# Altium project LEDCube.PrjPCB
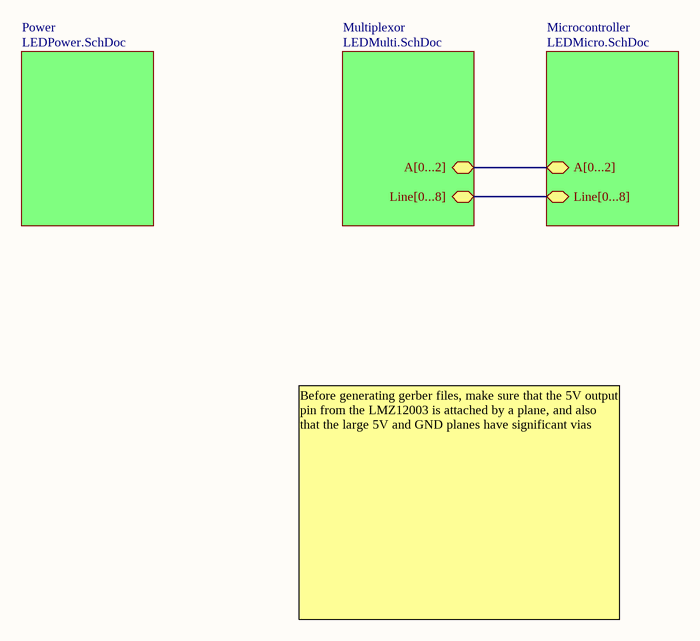
[diagram p0: Main.SchDoc]
4 sheets, 176 parts. Net scope: global (net labels, ports and power ports of the same name join across sheets).
Board file: LEDCube.PcbDoc
Sheets:
  Main.SchDoc
    Power = LEDPower.SchDoc
    Multiplexor = LEDMulti.SchDoc
    Microcontroller = LEDMicro.SchDOc

## Sheet Main.SchDoc
size A

### Sub-sheets
Microcontroller = LEDMicro.SchDoc: Line[0...8], A[0...2]
Multiplexor = LEDMulti.SchDoc: Line[0...8], A[0...2]
Power = LEDPower.SchDoc: no entries

### Buses and harness runs
bus sheet Microcontroller/A[0...2] = sheet Multiplexor/A[0...2]
bus sheet Microcontroller/Line[0...8] = sheet Multiplexor/Line[0...8]

### Notes on the sheet
- Before generating gerber files, make sure that the 5V output pin from the LMZ12003 is attached by a plane, and also that the large 5V and GND planes have significant vias

## Sheet LEDPower.SchDoc
size A
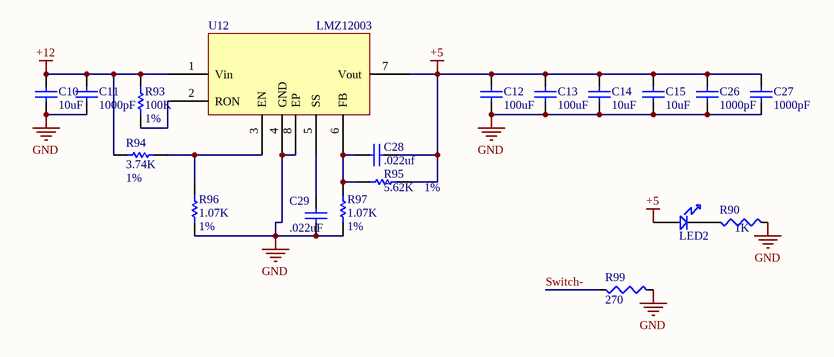
[diagram p1: LEDPower.SchDoc]

### Parts
C10  10uF  [0805 (2012) Capacitor]
C11  1000pF  [0805 (2012) Capacitor]
C12  100uF  [1210 (3225) Capacitor]
C13  100uF  [1210 (3225) Capacitor]
C14  10uF  [0805 (2012) Capacitor]
C15  10uF  [0805 (2012) Capacitor]
C26  1000pF  [0805 (2012) Capacitor]
C27  1000pF  [0805 (2012) Capacitor]
C28  .022uf  [0805 (2012) Capacitor]
C29  .022uF  [0805 (2012) Capacitor]
LED2  LED  [LED 0805]  (value not drawn)
R90  1K  [0805 (2012) Capacitor]
R93  Tolerance: 1%  [R 0805 (2012) RESISTOR]  (hidden comment: 100K)
R94  Tolerance: 1%  [R 0805 (2012) RESISTOR]  (hidden comment: 3.74K)
R95  Tolerance: 1%  [R 0805 (2012) RESISTOR]  (hidden comment: 5.62K)
R96  Tolerance: 1%  [R 0805 (2012) RESISTOR]  (hidden comment: 1.07K)
R97  Tolerance: 1%  [R 0805 (2012) RESISTOR]  (hidden comment: 1.07K)
R99  270  [0805 (2012) Capacitor]
U12  LMZ12003  [7-Lead PFM]

### Nets
+5: C12.2 C13.2 C14.1 C15.1 C26.1 C27.1 C28.1 LED2.2 R95.1 U12.7(Vout)
+12: C10.2 C11.2 R93.2 R94.2 U12.1(Vin)
GND: C10.1 C11.1 C12.1 C13.1 C14.2 C15.2 C26.2 C27.2 C29.1 R90.2 R96.1 R97.2 R99.2 U12.4(GND) U12.8(EP)
Switch-: R99.1
NetC28_2: C28.2 R95.2 R97.1 U12.6(FB)
NetC29_2: C29.2 U12.5(SS)
NetLED2_1: LED2.1 R90.1
NetR93_1: R93.1 U12.2(RON)
NetR94_1: R94.1 R96.2 U12.3(EN)

### Library data of the parts
C10 = Capacitor (non-polarized): Capacitor; Voltage Rating: 25 V; Value: 10uF
C11 = Capacitor (non-polarized): Capacitor; Voltage Rating: 25V; Value: 1000pF
C12-C15 C26-C29 = Capacitor (non-polarized): Capacitor
  C12 C13: Value: 100uF
  C14 C15: Value: 10uF
  C26 C27: Value: 1000pF
  C28: Value: .022uf
  C29: Value: .022uF
LED2 = LED: Standard LED
R90 R99 = Resistor: Value: 0Ohm
R93-R97 = RES 0805 1K 1%
  R93: Value: 100K
  R94: Value: 3.74K
  R95: Value: 5.62K
  R96 R97: Value: 1.07K

## Sheet LEDMulti.SchDoc
size Tabloid
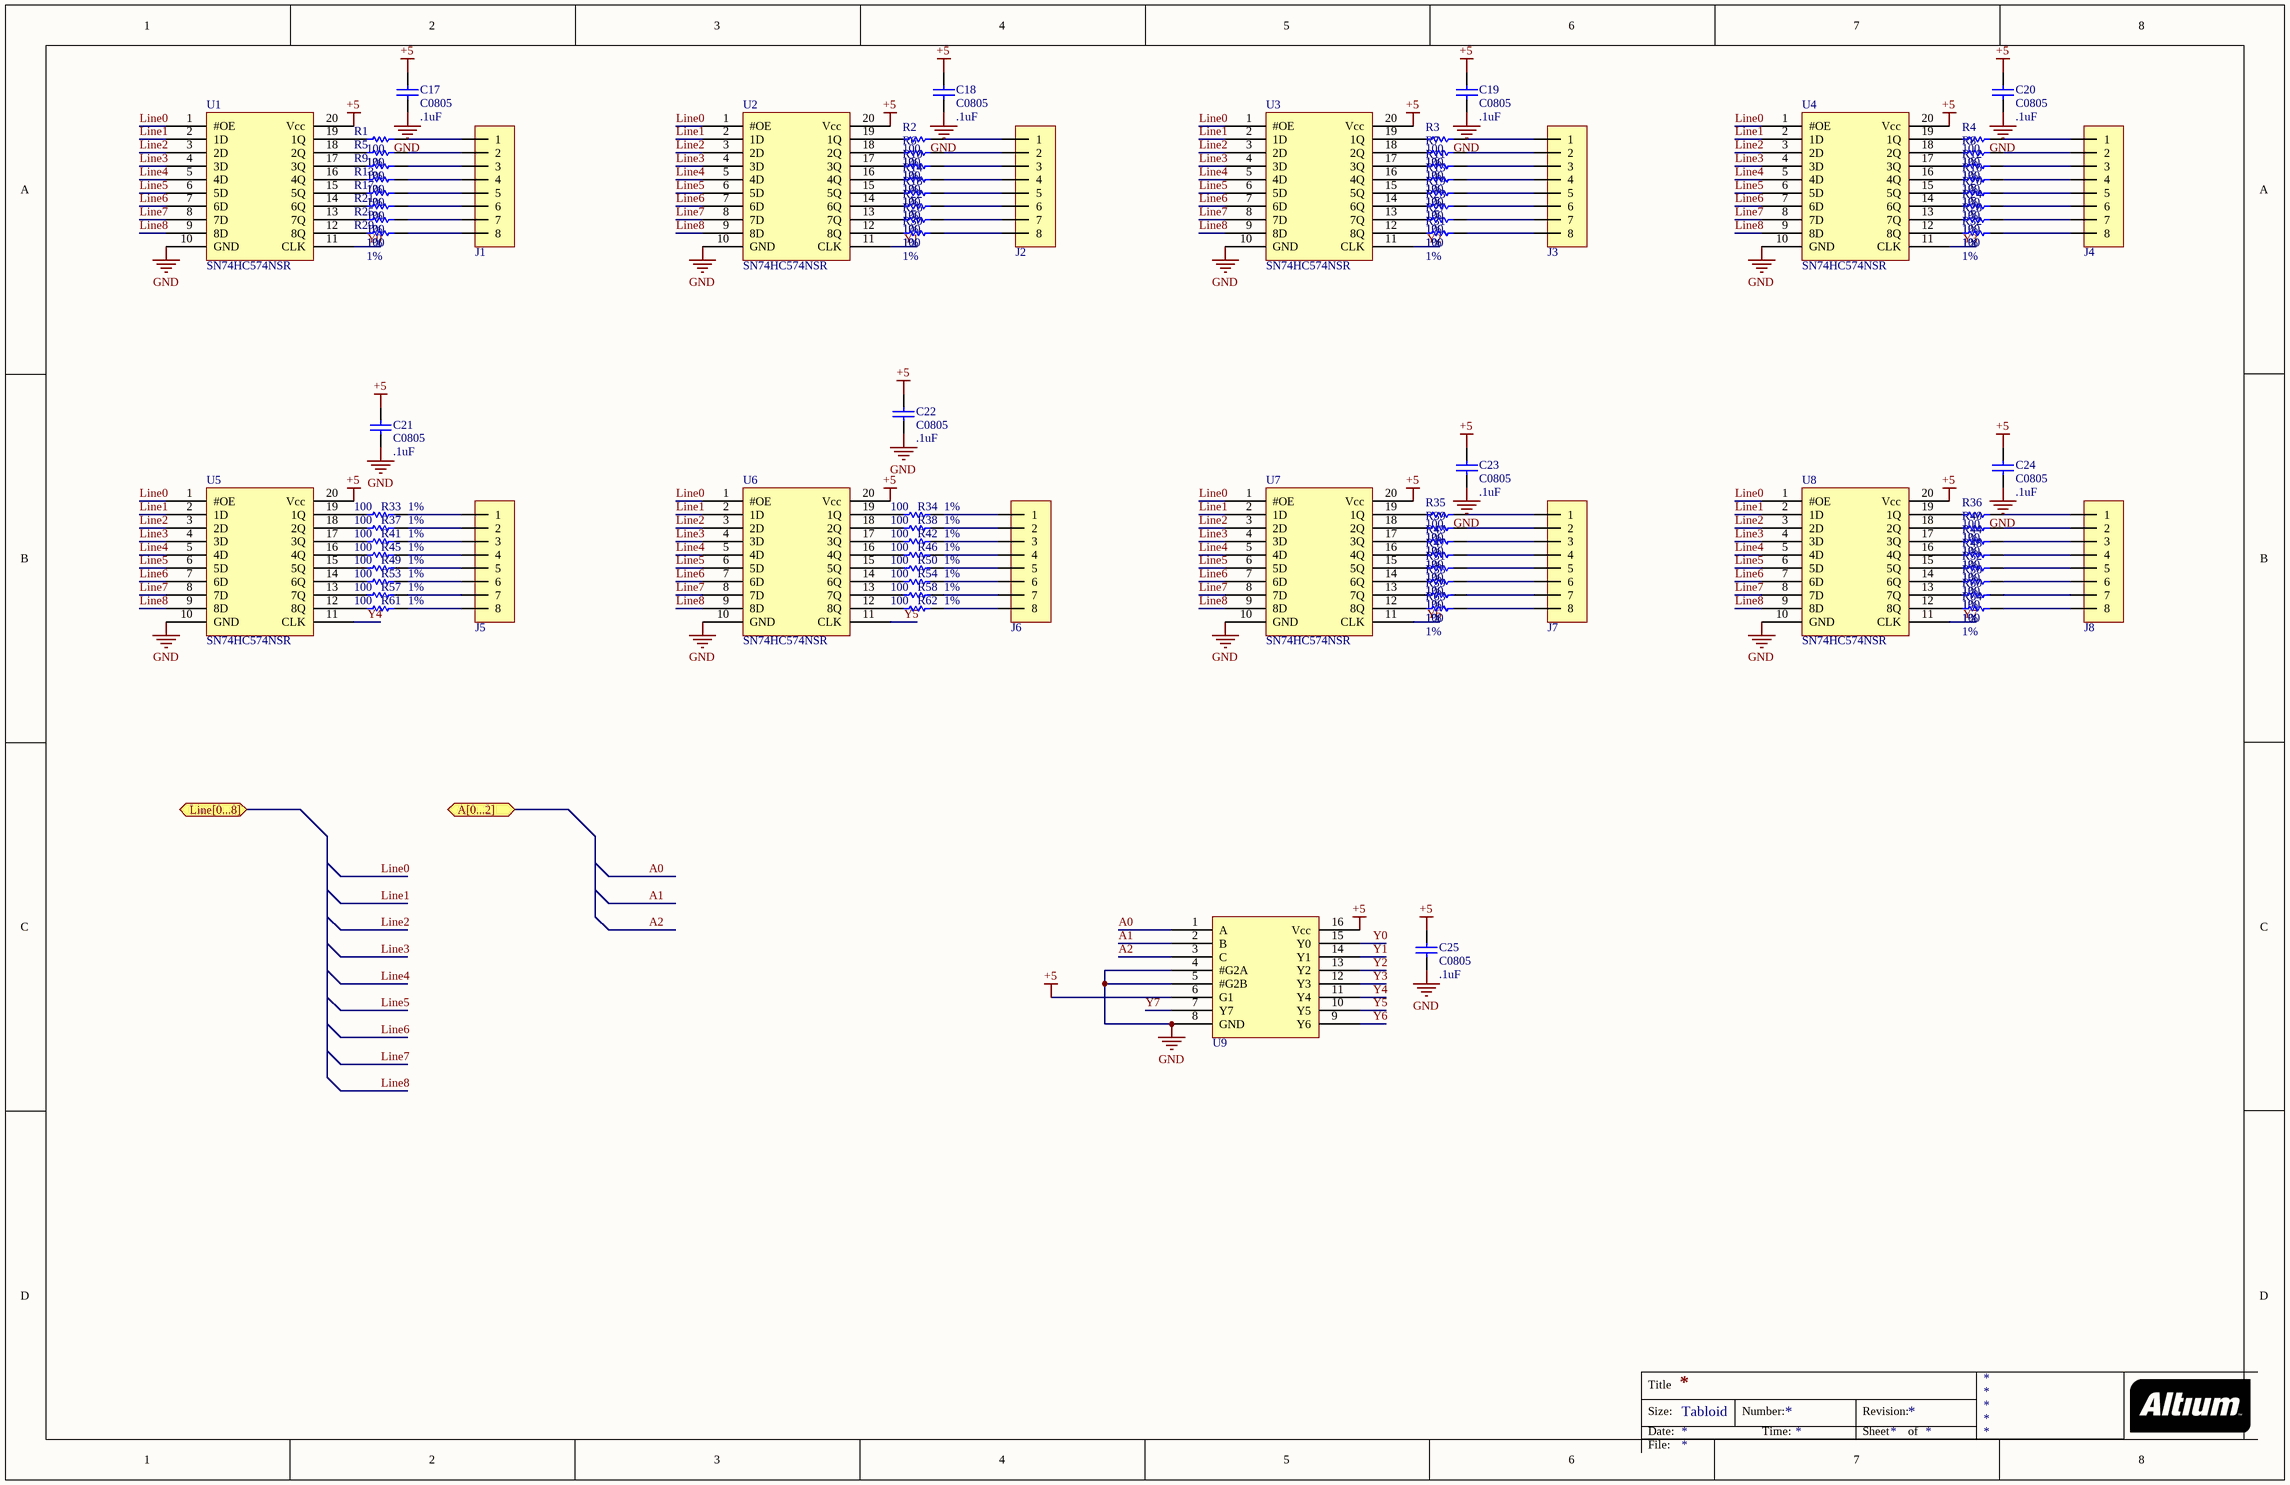
[diagram p2: LEDMulti.SchDoc]

### Parts
C17  C0805  value .1uF  [0805]
C18  C0805  value .1uF  [0805]
C19  C0805  value .1uF  [0805]
C20  C0805  value .1uF  [0805]
C21  C0805  value .1uF  [0805]
C22  C0805  value .1uF  [0805]
C23  C0805  value .1uF  [0805]
C24  C0805  value .1uF  [0805]
C25  C0805  value .1uF  [0805]
J1  8x1 Male Header Pin  [Male 8x1]  (value not drawn)
J2  8x1 Male Header Pin  [Male 8x1]  (value not drawn)
J3  8x1 Male Header Pin  [Male 8x1]  (value not drawn)
J4  8x1 Male Header Pin  [Male 8x1]  (value not drawn)
J5  8x1 Male Header Pin  [Male 8x1]  (value not drawn)
J6  8x1 Male Header Pin  [Male 8x1]  (value not drawn)
J7  8x1 Male Header Pin  [Male 8x1]  (value not drawn)
J8  8x1 Male Header Pin  [Male 8x1]  (value not drawn)
R1  Tolerance: 1%  [R 0805 (2012) RESISTOR]  (hidden comment: 100)
R2  Tolerance: 1%  [R 0805 (2012) RESISTOR]  (hidden comment: 100)
R3  Tolerance: 1%  [R 0805 (2012) RESISTOR]  (hidden comment: 100)
R4  Tolerance: 1%  [R 0805 (2012) RESISTOR]  (hidden comment: 100)
R5  Tolerance: 1%  [R 0805 (2012) RESISTOR]  (hidden comment: 100)
R6  Tolerance: 1%  [R 0805 (2012) RESISTOR]  (hidden comment: 100)
R7  Tolerance: 1%  [R 0805 (2012) RESISTOR]  (hidden comment: 100)
R8  Tolerance: 1%  [R 0805 (2012) RESISTOR]  (hidden comment: 100)
R9  Tolerance: 1%  [R 0805 (2012) RESISTOR]  (hidden comment: 100)
R10  Tolerance: 1%  [R 0805 (2012) RESISTOR]  (hidden comment: 100)
R11  Tolerance: 1%  [R 0805 (2012) RESISTOR]  (hidden comment: 100)
R12  Tolerance: 1%  [R 0805 (2012) RESISTOR]  (hidden comment: 100)
R13  Tolerance: 1%  [R 0805 (2012) RESISTOR]  (hidden comment: 100)
R14  Tolerance: 1%  [R 0805 (2012) RESISTOR]  (hidden comment: 100)
R15  Tolerance: 1%  [R 0805 (2012) RESISTOR]  (hidden comment: 100)
R16  Tolerance: 1%  [R 0805 (2012) RESISTOR]  (hidden comment: 100)
R17  Tolerance: 1%  [R 0805 (2012) RESISTOR]  (hidden comment: 100)
R18  Tolerance: 1%  [R 0805 (2012) RESISTOR]  (hidden comment: 100)
R19  Tolerance: 1%  [R 0805 (2012) RESISTOR]  (hidden comment: 100)
R20  Tolerance: 1%  [R 0805 (2012) RESISTOR]  (hidden comment: 100)
R21  Tolerance: 1%  [R 0805 (2012) RESISTOR]  (hidden comment: 100)
R22  Tolerance: 1%  [R 0805 (2012) RESISTOR]  (hidden comment: 100)
R23  Tolerance: 1%  [R 0805 (2012) RESISTOR]  (hidden comment: 100)
R24  Tolerance: 1%  [R 0805 (2012) RESISTOR]  (hidden comment: 100)
R25  Tolerance: 1%  [R 0805 (2012) RESISTOR]  (hidden comment: 100)
R26  Tolerance: 1%  [R 0805 (2012) RESISTOR]  (hidden comment: 100)
R27  Tolerance: 1%  [R 0805 (2012) RESISTOR]  (hidden comment: 100)
R28  Tolerance: 1%  [R 0805 (2012) RESISTOR]  (hidden comment: 100)
R29  Tolerance: 1%  [R 0805 (2012) RESISTOR]  (hidden comment: 100)
R30  Tolerance: 1%  [R 0805 (2012) RESISTOR]  (hidden comment: 100)
R31  Tolerance: 1%  [R 0805 (2012) RESISTOR]  (hidden comment: 100)
R32  Tolerance: 1%  [R 0805 (2012) RESISTOR]  (hidden comment: 100)
R33  Tolerance: 1%  [R 0805 (2012) RESISTOR]  (hidden comment: 100)
R34  Tolerance: 1%  [R 0805 (2012) RESISTOR]  (hidden comment: 100)
R35  Tolerance: 1%  [R 0805 (2012) RESISTOR]  (hidden comment: 100)
R36  Tolerance: 1%  [R 0805 (2012) RESISTOR]  (hidden comment: 100)
R37  Tolerance: 1%  [R 0805 (2012) RESISTOR]  (hidden comment: 100)
R38  Tolerance: 1%  [R 0805 (2012) RESISTOR]  (hidden comment: 100)
R39  Tolerance: 1%  [R 0805 (2012) RESISTOR]  (hidden comment: 100)
R40  Tolerance: 1%  [R 0805 (2012) RESISTOR]  (hidden comment: 100)
R41  Tolerance: 1%  [R 0805 (2012) RESISTOR]  (hidden comment: 100)
R42  Tolerance: 1%  [R 0805 (2012) RESISTOR]  (hidden comment: 100)
R43  Tolerance: 1%  [R 0805 (2012) RESISTOR]  (hidden comment: 100)
R44  Tolerance: 1%  [R 0805 (2012) RESISTOR]  (hidden comment: 100)
R45  Tolerance: 1%  [R 0805 (2012) RESISTOR]  (hidden comment: 100)
R46  Tolerance: 1%  [R 0805 (2012) RESISTOR]  (hidden comment: 100)
R47  Tolerance: 1%  [R 0805 (2012) RESISTOR]  (hidden comment: 100)
R48  Tolerance: 1%  [R 0805 (2012) RESISTOR]  (hidden comment: 100)
R49  Tolerance: 1%  [R 0805 (2012) RESISTOR]  (hidden comment: 100)
R50  Tolerance: 1%  [R 0805 (2012) RESISTOR]  (hidden comment: 100)
R51  Tolerance: 1%  [R 0805 (2012) RESISTOR]  (hidden comment: 100)
R52  Tolerance: 1%  [R 0805 (2012) RESISTOR]  (hidden comment: 100)
R53  Tolerance: 1%  [R 0805 (2012) RESISTOR]  (hidden comment: 100)
R54  Tolerance: 1%  [R 0805 (2012) RESISTOR]  (hidden comment: 100)
R55  Tolerance: 1%  [R 0805 (2012) RESISTOR]  (hidden comment: 100)
R56  Tolerance: 1%  [R 0805 (2012) RESISTOR]  (hidden comment: 100)
R57  Tolerance: 1%  [R 0805 (2012) RESISTOR]  (hidden comment: 100)
R58  Tolerance: 1%  [R 0805 (2012) RESISTOR]  (hidden comment: 100)
R59  Tolerance: 1%  [R 0805 (2012) RESISTOR]  (hidden comment: 100)
R60  Tolerance: 1%  [R 0805 (2012) RESISTOR]  (hidden comment: 100)
R61  Tolerance: 1%  [R 0805 (2012) RESISTOR]  (hidden comment: 100)
R62  Tolerance: 1%  [R 0805 (2012) RESISTOR]  (hidden comment: 100)
R63  Tolerance: 1%  [R 0805 (2012) RESISTOR]  (hidden comment: 100)
R64  Tolerance: 1%  [R 0805 (2012) RESISTOR]  (hidden comment: 100)
U1  SN74HC574NSR  [TSSOP 20]
U2  SN74HC574NSR  [TSSOP 20]
U3  SN74HC574NSR  [TSSOP 20]
U4  SN74HC574NSR  [TSSOP 20]
U5  SN74HC574NSR  [TSSOP 20]
U6  SN74HC574NSR  [TSSOP 20]
U7  SN74HC574NSR  [TSSOP 20]
U8  SN74HC574NSR  [TSSOP 20]
U9  SN74HC138N  [SOP16]  (value not drawn)

### Ports
A[0...2], Line[0...8]

### Nets
+5: C17.2 C18.2 C19.2 C20.2 C21.2 C22.2 C23.2 C24.2 C25.2 U1.20(Vcc) U2.20(Vcc) U3.20(Vcc) U4.20(Vcc) U5.20(Vcc) U6.20(Vcc) U7.20(Vcc) U8.20(Vcc) U9.6(G1) U9.16(Vcc)
GND: C17.1 C18.1 C19.1 C20.1 C21.1 C22.1 C23.1 C24.1 C25.1 U1.10(GND) U2.10(GND) U3.10(GND) U4.10(GND) U5.10(GND) U6.10(GND) U7.10(GND) U8.10(GND) U9.4(#G2A) U9.5(#G2B) U9.8(GND)
A0: U9.1(A)
A1: U9.2(B)
A2: U9.3(C)
Line0: U1.1(#OE) U2.1(#OE) U3.1(#OE) U4.1(#OE) U5.1(#OE) U6.1(#OE) U7.1(#OE) U8.1(#OE)
Line1: U1.2(1D) U2.2(1D) U3.2(1D) U4.2(1D) U5.2(1D) U6.2(1D) U7.2(1D) U8.2(1D)
Line2: U1.3(2D) U2.3(2D) U3.3(2D) U4.3(2D) U5.3(2D) U6.3(2D) U7.3(2D) U8.3(2D)
Line3: U1.4(3D) U2.4(3D) U3.4(3D) U4.4(3D) U5.4(3D) U6.4(3D) U7.4(3D) U8.4(3D)
Line4: U1.5(4D) U2.5(4D) U3.5(4D) U4.5(4D) U5.5(4D) U6.5(4D) U7.5(4D) U8.5(4D)
Line5: U1.6(5D) U2.6(5D) U3.6(5D) U4.6(5D) U5.6(5D) U6.6(5D) U7.6(5D) U8.6(5D)
Line6: U1.7(6D) U2.7(6D) U3.7(6D) U4.7(6D) U5.7(6D) U6.7(6D) U7.7(6D) U8.7(6D)
Line7: U1.8(7D) U2.8(7D) U3.8(7D) U4.8(7D) U5.8(7D) U6.8(7D) U7.8(7D) U8.8(7D)
Line8: U1.9(8D) U2.9(8D) U3.9(8D) U4.9(8D) U5.9(8D) U6.9(8D) U7.9(8D) U8.9(8D)
Y0: U1.11(CLK) U9.15(Y0)
Y1: U2.11(CLK) U9.14(Y1)
Y2: U3.11(CLK) U9.13(Y2)
Y3: U4.11(CLK) U9.12(Y3)
Y4: U5.11(CLK) U9.11(Y4)
Y5: U6.11(CLK) U9.10(Y5)
Y6: U7.11(CLK) U9.9(Y6)
Y7: U8.11(CLK) U9.7(Y7)
NetJ1_1: J1.1 R1.2
NetJ1_2: J1.2 R5.2
NetJ1_3: J1.3 R9.2
NetJ1_4: J1.4 R13.2
NetJ1_5: J1.5 R17.2
NetJ1_6: J1.6 R21.2
NetJ1_7: J1.7 R25.2
NetJ1_8: J1.8 R29.2
NetJ2_1: J2.1 R2.2
NetJ2_2: J2.2 R6.2
NetJ2_3: J2.3 R10.2
NetJ2_4: J2.4 R14.2
NetJ2_5: J2.5 R18.2
NetJ2_6: J2.6 R22.2
NetJ2_7: J2.7 R26.2
NetJ2_8: J2.8 R30.2
NetJ3_1: J3.1 R3.2
NetJ3_2: J3.2 R7.2
NetJ3_3: J3.3 R11.2
NetJ3_4: J3.4 R15.2
NetJ3_5: J3.5 R19.2
NetJ3_6: J3.6 R23.2
NetJ3_7: J3.7 R27.2
NetJ3_8: J3.8 R31.2
NetJ4_1: J4.1 R4.2
NetJ4_2: J4.2 R8.2
NetJ4_3: J4.3 R12.2
NetJ4_4: J4.4 R16.2
NetJ4_5: J4.5 R20.2
NetJ4_6: J4.6 R24.2
NetJ4_7: J4.7 R28.2
NetJ4_8: J4.8 R32.2
NetJ5_1: J5.1 R33.2
NetJ5_2: J5.2 R37.2
NetJ5_3: J5.3 R41.2
NetJ5_4: J5.4 R45.2
NetJ5_5: J5.5 R49.2
NetJ5_6: J5.6 R53.2
NetJ5_7: J5.7 R57.2
NetJ5_8: J5.8 R61.2
NetJ6_1: J6.1 R34.2
NetJ6_2: J6.2 R38.2
NetJ6_3: J6.3 R42.2
NetJ6_4: J6.4 R46.2
NetJ6_5: J6.5 R50.2
NetJ6_6: J6.6 R54.2
NetJ6_7: J6.7 R58.2
NetJ6_8: J6.8 R62.2
NetJ7_1: J7.1 R35.2
NetJ7_2: J7.2 R39.2
NetJ7_3: J7.3 R43.2
NetJ7_4: J7.4 R47.2
NetJ7_5: J7.5 R51.2
NetJ7_6: J7.6 R55.2
NetJ7_7: J7.7 R59.2
NetJ7_8: J7.8 R63.2
NetJ8_1: J8.1 R36.2
NetJ8_2: J8.2 R40.2
NetJ8_3: J8.3 R44.2
NetJ8_4: J8.4 R48.2
NetJ8_5: J8.5 R52.2
NetJ8_6: J8.6 R56.2
NetJ8_7: J8.7 R60.2
NetJ8_8: J8.8 R64.2
NetR1_1: R1.1 U1.19(1Q)
NetR2_1: R2.1 U2.19(1Q)
NetR3_1: R3.1 U3.19(1Q)
NetR4_1: R4.1 U4.19(1Q)
NetR5_1: R5.1 U1.18(2Q)
NetR6_1: R6.1 U2.18(2Q)
NetR7_1: R7.1 U3.18(2Q)
NetR8_1: R8.1 U4.18(2Q)
NetR9_1: R9.1 U1.17(3Q)
NetR10_1: R10.1 U2.17(3Q)
NetR11_1: R11.1 U3.17(3Q)
NetR12_1: R12.1 U4.17(3Q)
NetR13_1: R13.1 U1.16(4Q)
NetR14_1: R14.1 U2.16(4Q)
NetR15_1: R15.1 U3.16(4Q)
NetR16_1: R16.1 U4.16(4Q)
NetR17_1: R17.1 U1.15(5Q)
NetR18_1: R18.1 U2.15(5Q)
NetR19_1: R19.1 U3.15(5Q)
NetR20_1: R20.1 U4.15(5Q)
NetR21_1: R21.1 U1.14(6Q)
NetR22_1: R22.1 U2.14(6Q)
NetR23_1: R23.1 U3.14(6Q)
NetR24_1: R24.1 U4.14(6Q)
NetR25_1: R25.1 U1.13(7Q)
NetR26_1: R26.1 U2.13(7Q)
NetR27_1: R27.1 U3.13(7Q)
NetR28_1: R28.1 U4.13(7Q)
NetR29_1: R29.1 U1.12(8Q)
NetR30_1: R30.1 U2.12(8Q)
NetR31_1: R31.1 U3.12(8Q)
NetR32_1: R32.1 U4.12(8Q)
NetR33_1: R33.1 U5.19(1Q)
NetR34_1: R34.1 U6.19(1Q)
NetR35_1: R35.1 U7.19(1Q)
NetR36_1: R36.1 U8.19(1Q)
NetR37_1: R37.1 U5.18(2Q)
NetR38_1: R38.1 U6.18(2Q)
NetR39_1: R39.1 U7.18(2Q)
NetR40_1: R40.1 U8.18(2Q)
NetR41_1: R41.1 U5.17(3Q)
NetR42_1: R42.1 U6.17(3Q)
NetR43_1: R43.1 U7.17(3Q)
NetR44_1: R44.1 U8.17(3Q)
NetR45_1: R45.1 U5.16(4Q)
NetR46_1: R46.1 U6.16(4Q)
NetR47_1: R47.1 U7.16(4Q)
NetR48_1: R48.1 U8.16(4Q)
NetR49_1: R49.1 U5.15(5Q)
NetR50_1: R50.1 U6.15(5Q)
NetR51_1: R51.1 U7.15(5Q)
NetR52_1: R52.1 U8.15(5Q)
NetR53_1: R53.1 U5.14(6Q)
NetR54_1: R54.1 U6.14(6Q)
NetR55_1: R55.1 U7.14(6Q)
NetR56_1: R56.1 U8.14(6Q)
NetR57_1: R57.1 U5.13(7Q)
NetR58_1: R58.1 U6.13(7Q)
NetR59_1: R59.1 U7.13(7Q)
NetR60_1: R60.1 U8.13(7Q)
NetR61_1: R61.1 U5.12(8Q)
NetR62_1: R62.1 U6.12(8Q)
NetR63_1: R63.1 U7.12(8Q)
NetR64_1: R64.1 U8.12(8Q)

### Notes on the sheet
- Title
- Size:
- Date:
- Tabloid
- Number:
- Time:
- Revision:
- Sheet
- of
- File:

### Library data of the parts
C17-C25 = C0805: Ceramic Chip Capacitor - Standard; Note: Footprint corresponds to dimensions for bulk cassette packaging. This case size has tightened tolerances.; Published: 17-Jul-2002; LatestRevisionDate: 19-Mar-2004; LatestRevisionNote: Silkscreen size reduced.; DatasheetDocument: Mar-2001; PackageDocument: Mar-2001; PackageReference: 0805; Publisher: Altium Limited; Code_JEITA: 0805; Code_IPC: 2012[0805]; ComponentLink1Description: Manufacturer Link; ComponentLink1URL: http://www.kemet.com/; ComponentLink2Description: Datasheet; ComponentLink2URL: http://www.kemet.com/kemet/web/homepage/kechome.nsf/vapubfilesname/F3102TA.pdf/$file/F3102TA.pdf
J1-J8 = 8x1 Male Header Pin: 8x1 100mil Header
R1-R64 = RES 0805 1K 1%: Value: 100
U1-U8 = SN74HC574NSR: IC D-TYPE POS TRG SNGL 20SO
U9 = SN4HC138N: IC DECODER/DEMUX 3-8 LINE 16SO

## Sheet LEDMicro.SchDOc
size OrCAD E
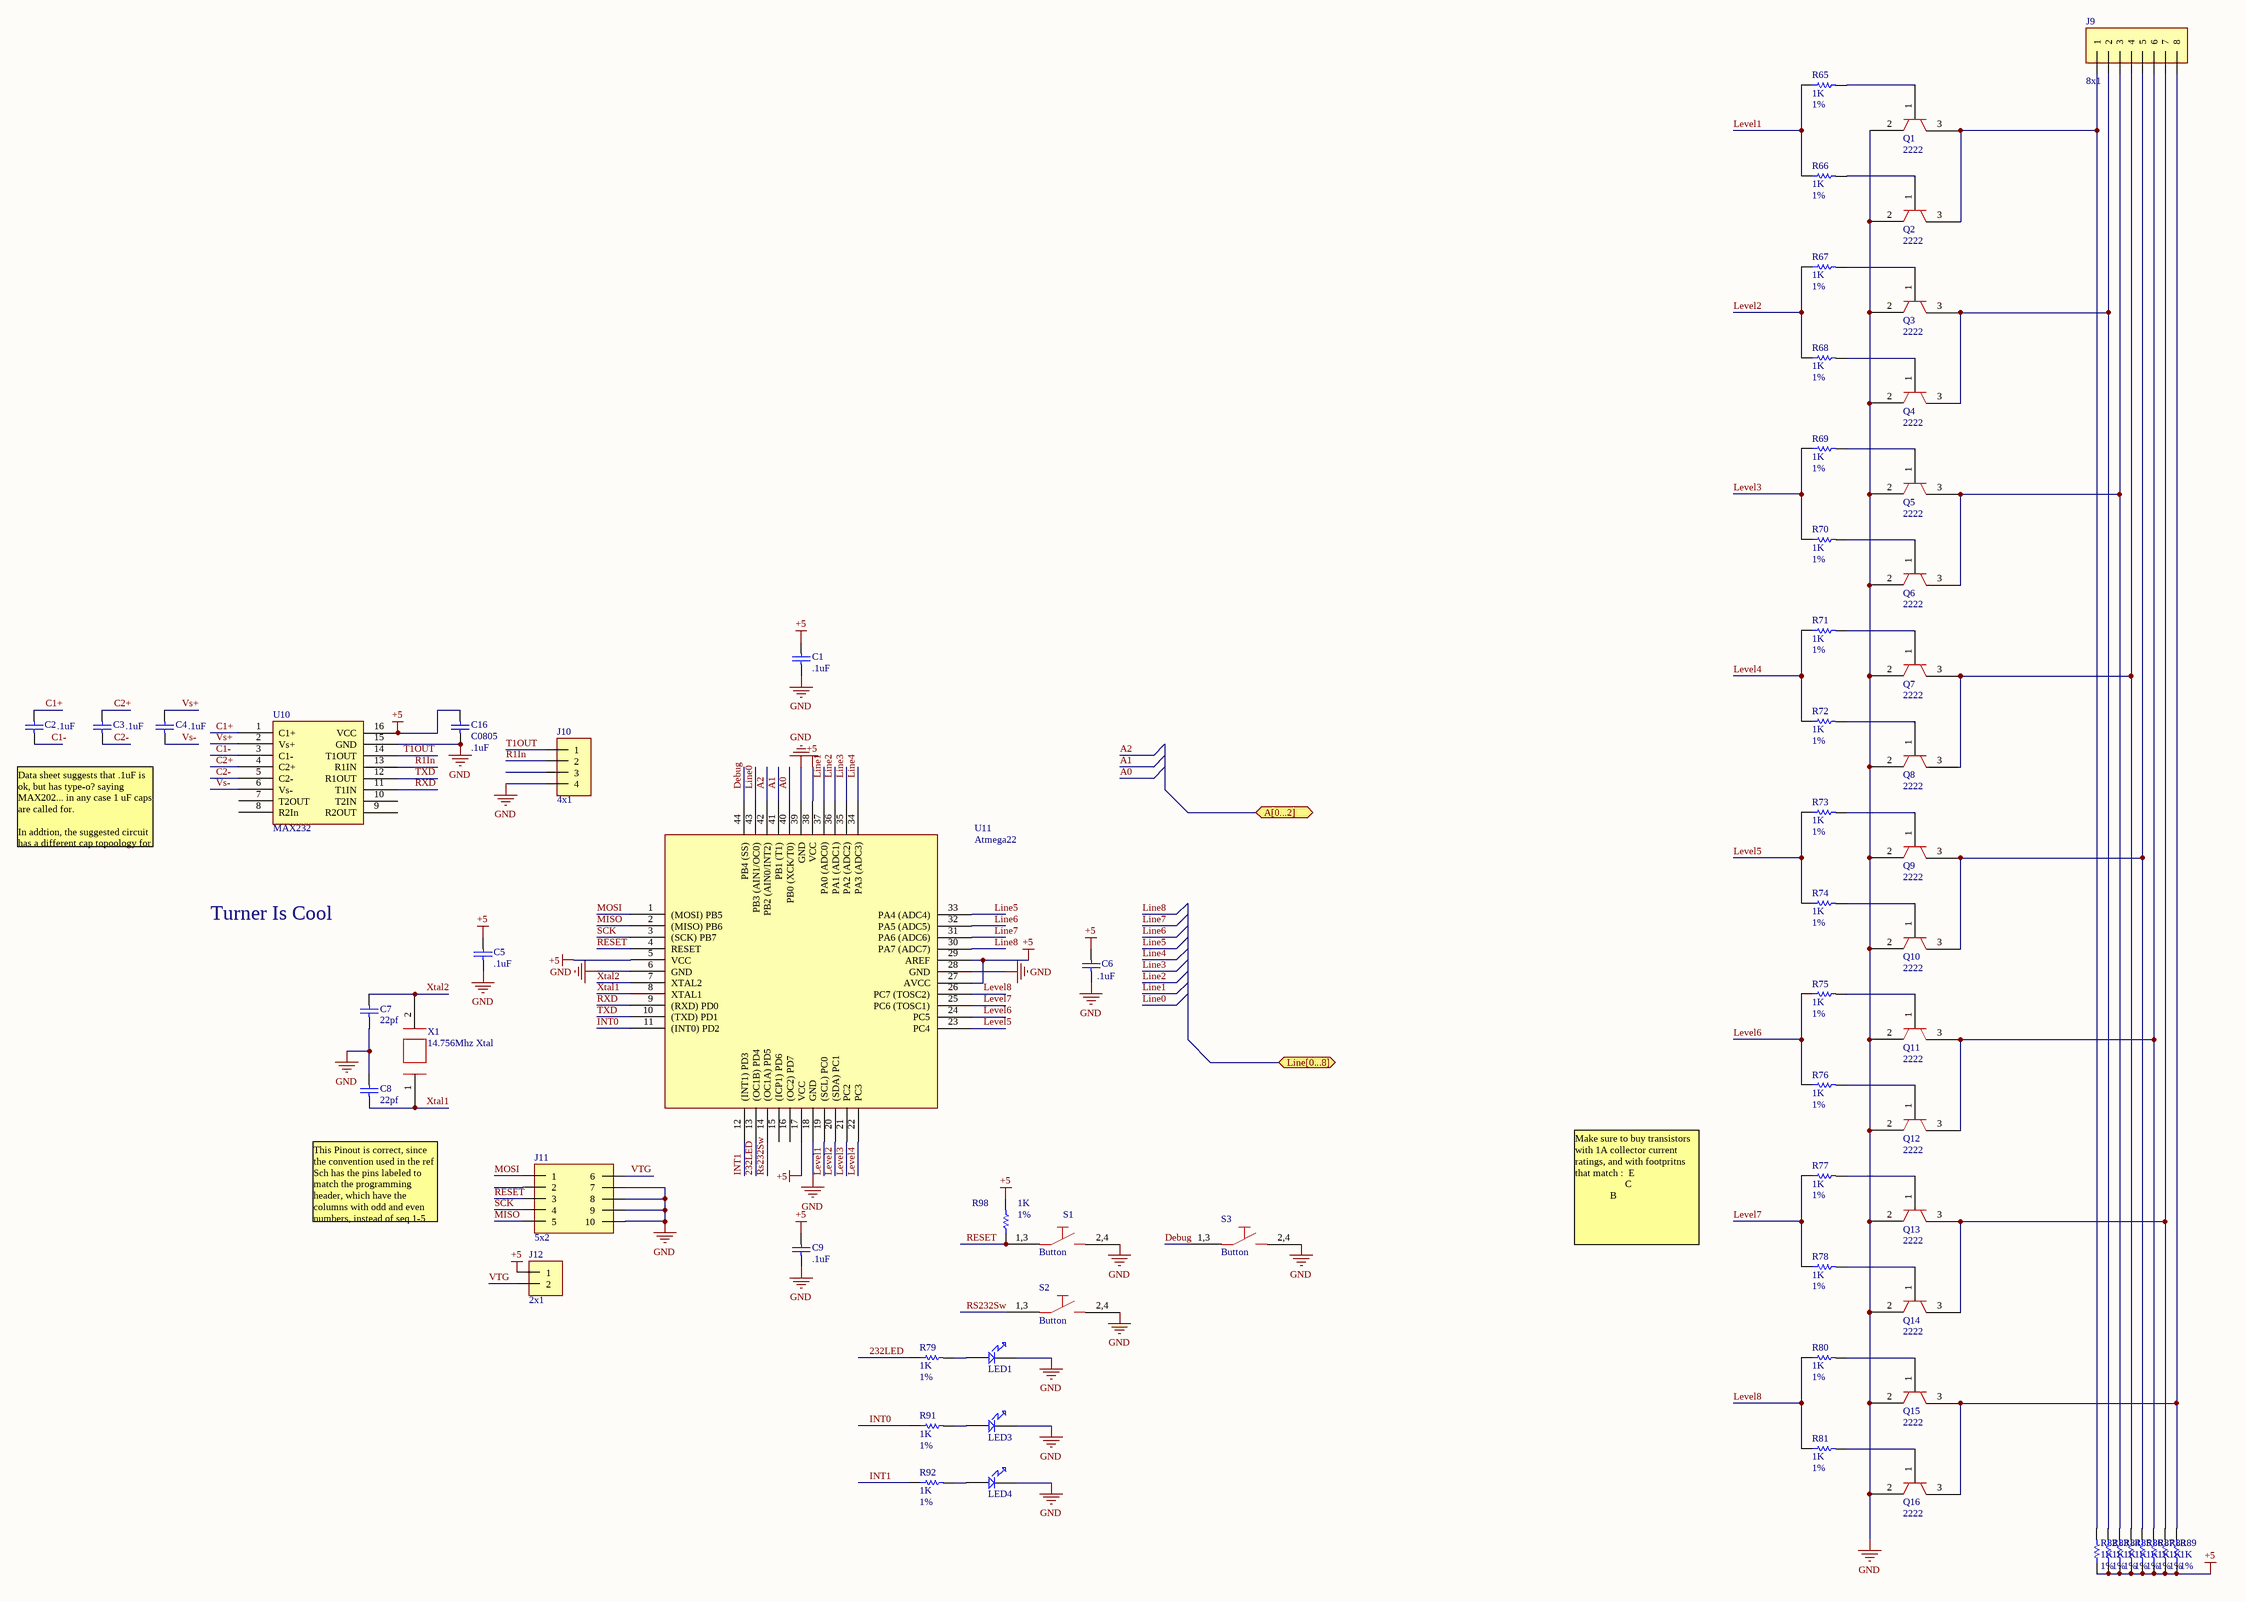
[diagram p3: LEDMicro.SchDOc]

### Parts
C1  .1uF  [0805 (2012) Capacitor]
C2  .1uF  [0805 (2012) Capacitor]
C3  .1uF  [0805 (2012) Capacitor]
C4  .1uF  [0805 (2012) Capacitor]
C5  .1uF  [0805 (2012) Capacitor]
C6  .1uF  [0805 (2012) Capacitor]
C7  22pf  [0603]
C8  22pf  [0603]
C9  .1uF  [0805 (2012) Capacitor]
C16  C0805  value .1uF  [0805]
J9  8x1  [Male 8x1]
J10  4x1  [Male 4x1]
J11  5x2  [Male 5x2]
J12  2x1  [Male 2X1]
LED1  LED  [LED 0805]  (value not drawn)
LED3  LED  [LED 0805]  (value not drawn)
LED4  LED  [LED 0805]  (value not drawn)
Q1  2222  [SOT-23]
Q2  2222  [SOT-23]
Q3  2222  [SOT-23]
Q4  2222  [SOT-23]
Q5  2222  [SOT-23]
Q6  2222  [SOT-23]
Q7  2222  [SOT-23]
Q8  2222  [SOT-23]
Q9  2222  [SOT-23]
Q10  2222  [SOT-23]
Q11  2222  [SOT-23]
Q12  2222  [SOT-23]
Q13  2222  [SOT-23]
Q14  2222  [SOT-23]
Q15  2222  [SOT-23]
Q16  2222  [SOT-23]
R65  Tolerance: 1%  [R 0805 (2012) RESISTOR]  (hidden comment: 1K)
R66  Tolerance: 1%  [R 0805 (2012) RESISTOR]  (hidden comment: 1K)
R67  Tolerance: 1%  [R 0805 (2012) RESISTOR]  (hidden comment: 1K)
R68  Tolerance: 1%  [R 0805 (2012) RESISTOR]  (hidden comment: 1K)
R69  Tolerance: 1%  [R 0805 (2012) RESISTOR]  (hidden comment: 1K)
R70  Tolerance: 1%  [R 0805 (2012) RESISTOR]  (hidden comment: 1K)
R71  Tolerance: 1%  [R 0805 (2012) RESISTOR]  (hidden comment: 1K)
R72  Tolerance: 1%  [R 0805 (2012) RESISTOR]  (hidden comment: 1K)
R73  Tolerance: 1%  [R 0805 (2012) RESISTOR]  (hidden comment: 1K)
R74  Tolerance: 1%  [R 0805 (2012) RESISTOR]  (hidden comment: 1K)
R75  Tolerance: 1%  [R 0805 (2012) RESISTOR]  (hidden comment: 1K)
R76  Tolerance: 1%  [R 0805 (2012) RESISTOR]  (hidden comment: 1K)
R77  Tolerance: 1%  [R 0805 (2012) RESISTOR]  (hidden comment: 1K)
R78  Tolerance: 1%  [R 0805 (2012) RESISTOR]  (hidden comment: 1K)
R79  Tolerance: 1%  [R 0805 (2012) RESISTOR]  (hidden comment: 1K)
R80  Tolerance: 1%  [R 0805 (2012) RESISTOR]  (hidden comment: 1K)
R81  Tolerance: 1%  [R 0805 (2012) RESISTOR]  (hidden comment: 1K)
R82  Tolerance: 1%  [R 0805 (2012) RESISTOR]  (hidden comment: 1K)
R83  Tolerance: 1%  [R 0805 (2012) RESISTOR]  (hidden comment: 1K)
R84  Tolerance: 1%  [R 0805 (2012) RESISTOR]  (hidden comment: 1K)
R85  Tolerance: 1%  [R 0805 (2012) RESISTOR]  (hidden comment: 1K)
R86  Tolerance: 1%  [R 0805 (2012) RESISTOR]  (hidden comment: 1K)
R87  Tolerance: 1%  [R 0805 (2012) RESISTOR]  (hidden comment: 1K)
R88  Tolerance: 1%  [R 0805 (2012) RESISTOR]  (hidden comment: 1K)
R89  Tolerance: 1%  [R 0805 (2012) RESISTOR]  (hidden comment: 1K)
R91  Tolerance: 1%  [R 0805 (2012) RESISTOR]  (hidden comment: 1K)
R92  Tolerance: 1%  [R 0805 (2012) RESISTOR]  (hidden comment: 1K)
R98  Tolerance: 1%  [R 0805 (2012) RESISTOR]  (hidden comment: 1K)
S1  Button  [B3F-1000]
S2  Button  [B3F-1000]
S3  Button  [B3F-1000]
U10  MAX232  [SOP16]
U11  Atmega22  [Quad44]
X1  14.756Mhz Xtal  [PCBComponent_1]

### Ports
A[0...2], Line[0...8]

### Nets
+5: C1.2 C5.2 C6.2 C9.2 C16.2 J12.1 R82.1 R83.1 R84.1 R85.1 R86.1 R87.1 R88.1 R89.1 R98.2 U10.16(VCC) U11.5(VCC) U11.17(VCC) U11.27(AVCC) U11.29(AREF) U11.38(VCC)
GND: C1.1 C5.1 C6.1 C7.1 C8.2 C9.1 C16.1 J10.4 J11.7 J11.8 J11.9 J11.10 LED1.1 LED3.1 LED4.1 Q1.2(E) Q2.2(E) Q3.2(E) Q4.2(E) Q5.2(E) Q6.2(E) Q7.2(E) Q8.2(E) Q9.2(E) Q10.2(E) Q11.2(E) Q12.2(E) Q13.2(E) Q14.2(E) Q15.2(E) Q16.2(E) S1.2,4 S2.2,4 S3.2,4 U10.15(GND) U11.6(GND) U11.18(GND) U11.28(GND) U11.39(GND)
232LED: R79.1 U11.13((OC1B)_PD4)
A0: U11.40(PB0_(XCK/T0))
A1: U11.41(PB1_(T1))
A2: U11.42(PB2_(AIN0/INT2))
C1+: C2.2 U10.1(C1+)
C1-: C2.1 U10.3(C1-)
C2+: C3.2 U10.4(C2+)
C2-: C3.1 U10.5(C2-)
Debug: S3.1,3 U11.44(PB4_(SS))
INT0: R91.1 U11.11((INT0)_PD2)
INT1: R92.1 U11.12((INT1)_PD3)
Level1: R65.1 R66.1 U11.19((SCL)_PC0)
Level2: R67.1 R68.1 U11.20((SDA)_PC1)
Level3: R69.1 R70.1 U11.21(PC2)
Level4: R71.1 R72.1 U11.22(PC3)
Level5: R73.1 R74.1 U11.23(PC4)
Level6: R75.1 R76.1 U11.24(PC5)
Level7: R77.1 R78.1 U11.25(PC6_(TOSC1))
Level8: R80.1 R81.1 U11.26(PC7_(TOSC2))
Line0: U11.43(PB3_(AIN1/OC0))
Line1: U11.37(PA0_(ADC0))
Line2: U11.36(PA1_(ADC1))
Line3: U11.35(PA2_(ADC2))
Line4: U11.34(PA3_(ADC3))
Line5: U11.33(PA4_(ADC4))
Line6: U11.32(PA5_(ADC5))
Line7: U11.31(PA6_(ADC6))
Line8: U11.30(PA7_(ADC7))
MISO: J11.5 U11.2((MISO)_PB6)
MOSI: J11.1 U11.1((MOSI)_PB5)
R1In: J10.2 U10.13(R1IN)
RESET: J11.3 R98.1 S1.1,3 U11.4(RESET)
Rs232Sw: S2.1,3 U11.14((OC1A)_PD5)
RXD: U10.11(T1IN) U11.9((RXD)_PD0)
SCK: J11.4 U11.3((SCK)_PB7)
T1OUT: J10.1 U10.14(T1OUT)
TXD: U10.12(R1OUT) U11.10((TXD)_PD1)
Vs+: C4.2 U10.2(Vs+)
Vs-: C4.1 U10.6(Vs-)
VTG: J11.6 J12.2
Xtal1: C8.1 U11.8(XTAL1) X1.1
Xtal2: C7.2 U11.7(XTAL2) X1.2
NetJ9_1: J9.1 Q1.3(C) Q2.3(C) R82.2
NetJ9_2: J9.2 Q3.3(C) Q4.3(C) R83.2
NetJ9_3: J9.3 Q5.3(C) Q6.3(C) R84.2
NetJ9_4: J9.4 Q7.3(C) Q8.3(C) R85.2
NetJ9_5: J9.5 Q9.3(C) Q10.3(C) R86.2
NetJ9_6: J9.6 Q11.3(C) Q12.3(C) R87.2
NetJ9_7: J9.7 Q13.3(C) Q14.3(C) R88.2
NetJ9_8: J9.8 Q15.3(C) Q16.3(C) R89.2
NetLED1_2: LED1.2 R79.2
NetLED3_2: LED3.2 R91.2
NetLED4_2: LED4.2 R92.2
NetQ1_1: Q1.1(B) R65.2
NetQ2_1: Q2.1(B) R66.2
NetQ3_1: Q3.1(B) R67.2
NetQ4_1: Q4.1(B) R68.2
NetQ5_1: Q5.1(B) R69.2
NetQ6_1: Q6.1(B) R70.2
NetQ7_1: Q7.1(B) R71.2
NetQ8_1: Q8.1(B) R72.2
NetQ9_1: Q9.1(B) R73.2
NetQ10_1: Q10.1(B) R74.2
NetQ11_1: Q11.1(B) R75.2
NetQ12_1: Q12.1(B) R76.2
NetQ13_1: Q13.1(B) R77.2
NetQ14_1: Q14.1(B) R78.2
NetQ15_1: Q15.1(B) R80.2
NetQ16_1: Q16.1(B) R81.2

Not connected (* = marked no-connect by the designer): J10 3; J11 2; U10 7(T2OUT) 8(R2In) 9(R2OUT) 10(T2IN); U11 15((ICP1)_PD6) 16((OC2)_PD7)

### Notes on the sheet
- Data sheet suggests that .1uF is ok, but has type-o? saying MAX202... in any case 1 uF caps are called for.
  In addtion, the suggested circuit has a different cap topoology for the VS+, VS- connections...
- Turner Is Cool
- This Pinout is correct, since the convention used in the ref Sch has the pins labeled to match the programming header, which have the columns with odd and even numbers, instead of seq 1-5 and 6-10. Keep in mind that to go from this sch to the ref sch, 2->3, 3->5, 4->7, 5->9, 6->2, 7->4, 8->6, 9->8, 10->10
- Make sure to buy transistors with 1A collector current ratings, and with footpritns that match :  E
  C
  B
- Title
- Size:
- Date:
- File:
- Orcad E
- Number:
- Time:
- Revision:
- Sheet
- of

### Library data of the parts
C1-C6 C9 = Capacitor (non-polarized): Capacitor; Value: .1uF
C7 C8 = Capacitor (non-polarized): Capacitor; Value: .1uF
C16 = C0805: as C17 on sheet LEDMulti; Published: 17-Jul-2002; LatestRevisionDate: 19-Mar-2004; LatestRevisionNote: Silkscreen size reduced.; DatasheetDocument: Mar-2001; PackageDocument: Mar-2001; PackageReference: 0805; Publisher: Altium Limited; Code_JEITA: 0805; Code_IPC: 2012[0805]; ComponentLink1Description: Manufacturer Link; ComponentLink1URL: http://www.kemet.com/; ComponentLink2Description: Datasheet; ComponentLink2URL: http://www.kemet.com/kemet/web/homepage/kechome.nsf/vapubfilesname/F3102TA.pdf/$file/F3102TA.pdf
J9 = 8x1: 8x1 100mil Header
J10 = 4x1: 4x1 100mil Header
J11 = 5x2: 5x2 100mil Header
J12 = 2x1: 2x1 100mil Header
LED1 LED3 LED4 = LED: Standard LED
Q1-Q16 = MMST2222A: Trans NPN Bipolar 40V
R65-R89 R91 R92 R98 = RES 0805 1K 1%: Value: 1K
U10 = MAX232: IC DUAL EIA-232 DRVR/RCVR 16SOIC
U11 = ATMEGA 32: IC MCU 8BIT 8KB FLASH 44TQFP
X1 = Crystal

## Nets that join several sheets
+5: LEDPower (10 pins), LEDMulti (19 pins), LEDMicro (21 pins)
GND: LEDPower (15 pins), LEDMulti (20 pins), LEDMicro (39 pins)
A0: LEDMulti (U9.1), LEDMicro (U11.40)
A1: LEDMulti (U9.2), LEDMicro (U11.41)
A2: LEDMulti (U9.3), LEDMicro (U11.42)
Line0: LEDMulti (8 pins), LEDMicro (U11.43)
Line1: LEDMulti (8 pins), LEDMicro (U11.37)
Line2: LEDMulti (8 pins), LEDMicro (U11.36)
Line3: LEDMulti (8 pins), LEDMicro (U11.35)
Line4: LEDMulti (8 pins), LEDMicro (U11.34)
Line5: LEDMulti (8 pins), LEDMicro (U11.33)
Line6: LEDMulti (8 pins), LEDMicro (U11.32)
Line7: LEDMulti (8 pins), LEDMicro (U11.31)
Line8: LEDMulti (8 pins), LEDMicro (U11.30)